# Altium schematic sheet MainCircuit.SchDoc: Controlador PID
size A4; Organization: Altium Limited; Address1: L3, 12a Rodborough Rd; Address2: Frenchs Forest; Address3: NSW; Address4: Australia 2086; Revision: R01; sheetnumberh: 2; sheettotall: 5; Alumno: Irumberry Juan - Matwiejczuk Leandro; Curso: 512; Materia: Técnicas Digitales III; Docentes: Ing. Marín Ariel; SheetNumber: 2; SheetTotal: 5
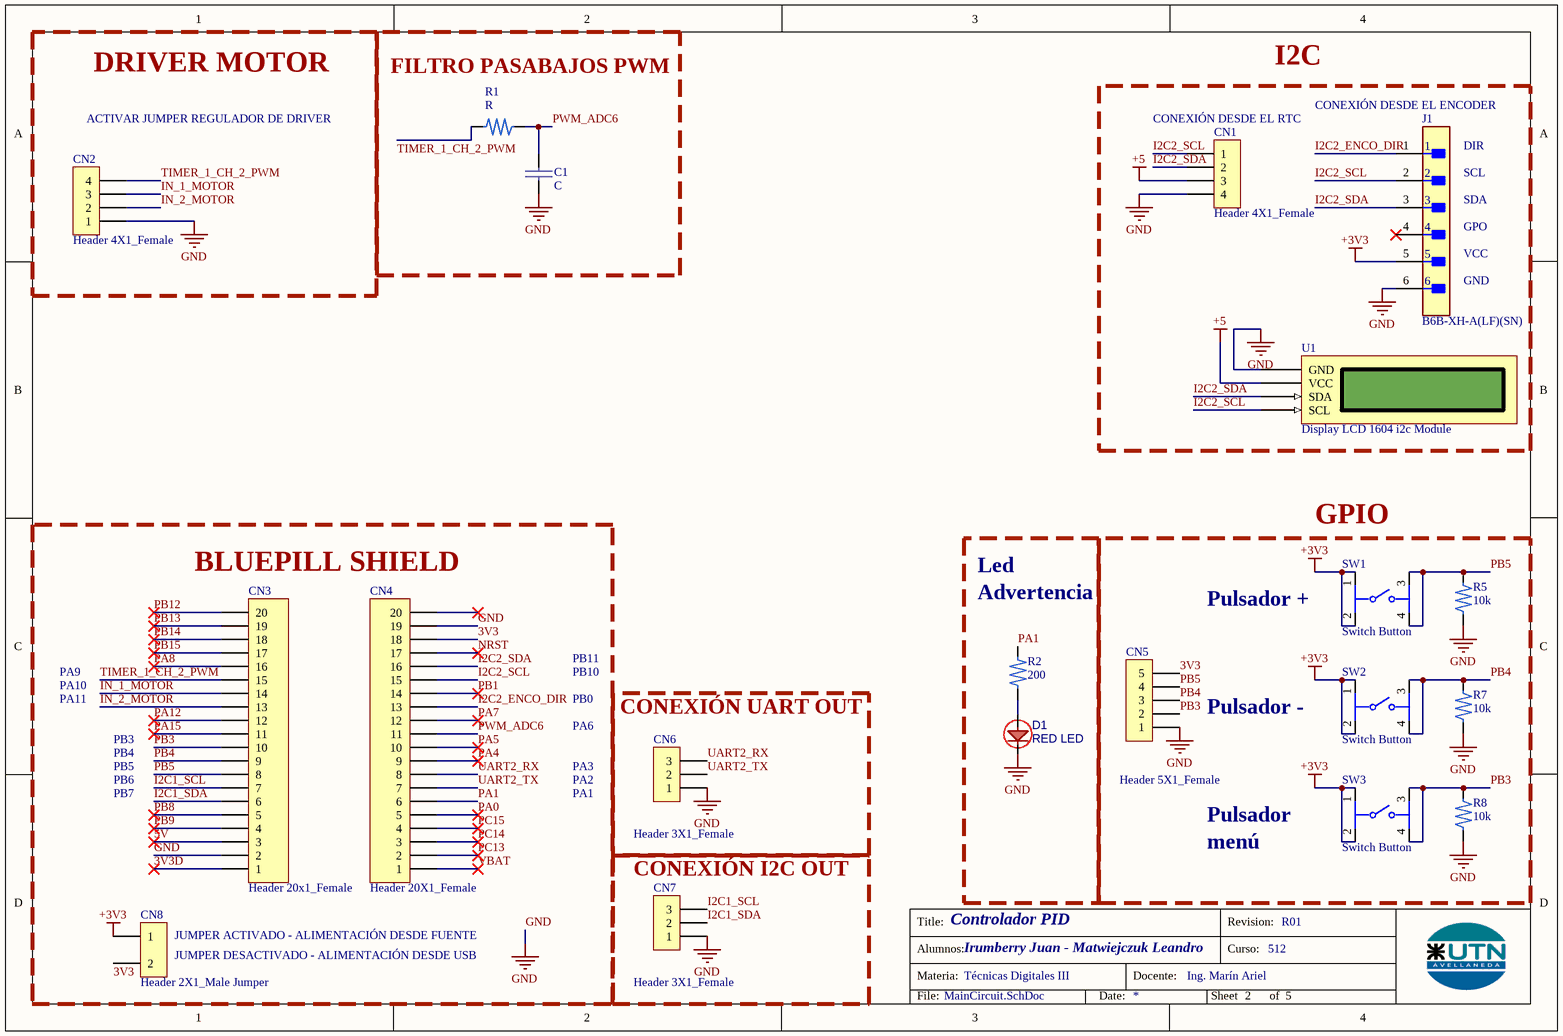
[diagram p0: MainCircuit.SchDoc]

## Parts
C1  C  [CAP_Axial_0.2mm]
CN1  Header 4X1_Female  [1*4P_FEMALE]
CN2  Header 4X1_Female  [1*4P_FEMALE]
CN3  Header 20x1_Female  [1*20P_FEMALE]
CN4  Header 20X1_Female  [1*20P_FEMALE]
CN5  Header 5X1_Female  [1*5P_FEMALE]
CN6  Header 3X1_Female  [1*3P_FEMALE]
CN7  Header 3X1_Female  [1*3P_FEMALE]
CN8  Header 2X1_Male Jumper  [JUMPER 2x1 PIN]
D1  RED LED  [LED_DIODE_3.9mm]
J1  B6B-XH-A(LF)(SN)  [JST 6 PIN CONNECTOR]
R1  R  [RES_AXIAL_3.2_6MM]
R2  200  [RES_AXIAL_3.2_6MM]
R5  10k  [RES_AXIAL_3.2_6MM]  (graphical)
R7  10k  [RES_AXIAL_3.2_6MM]  (graphical)
R8  10k  [RES_AXIAL_3.2_6MM]  (graphical)
SW1  Switch Button  [SWITCH]  (graphical)
SW2  Switch Button  [SWITCH]  (graphical)
SW3  Switch Button  [SWITCH]  (graphical)
U1  Display LCD 1604 i2c Module  [1*4P_FEMALE]

## Blocks framed on the sheet
DRIVER MOTOR: CN2
FILTRO PASABAJOS PWM: C1 R1
I2C: CN1 J1 U1
BLUEPILL SHIELD: CN3 CN4 CN8
GPIO: CN5 R5 R7 R8 SW1-SW3
CONEXIÓN UART OUT: CN6
CONEXIÓN I2C OUT: CN7

## Nets
+3V3: CN8.1 J1.5 SW1.1 SW1.2 SW2.1 SW2.2 SW3.1 SW3.2
+5: CN1.3 U1.2(VCC)
GND: C1.2 CN1.4 CN2.1 CN3.2 CN4.19 CN5.1 CN6.1 CN7.1 D1.K J1.6 R5.1 R7.1 R8.1 U1.1(GND)
3V3: CN4.18 CN5.5 CN8.2
3V3D: CN3.1
5V: CN3.3
I2C1_SCL: CN3.7 CN7.3
I2C1_SDA: CN3.6 CN7.2
I2C2_ENCO_DIR: CN4.13 J1.1
I2C2_SCL: CN1.1 CN4.15 J1.2 U1.4(SCL)
I2C2_SDA: CN1.2 CN4.16 J1.3 U1.3(SDA)
IN_1_MOTOR: CN2.3 CN3.14
IN_2_MOTOR: CN2.2 CN3.13
NRST: CN4.17
PA0: CN4.5
PA1: CN4.6 R2.2
PA4: CN4.9
PA5: CN4.10
PA7: CN4.12
PA8: CN3.16
PA12: CN3.12
PA15: CN3.11
PB1: CN4.14
PB3: CN3.10 CN5.2 R8.2 SW3.3 SW3.4
PB4: CN3.9 CN5.3 R7.2 SW2.3 SW2.4
PB5: CN3.8 CN5.4 R5.2 SW1.3 SW1.4
PB8: CN3.5
PB9: CN3.4
PB12: CN3.20
PB13: CN3.19
PB14: CN3.18
PB15: CN3.17
PC13: CN4.2
PC14: CN4.3
PC15: CN4.4
PWM_ADC6: C1.1 CN4.11 R1.2
TIMER_1_CH_2_PWM: CN2.4 CN3.15 R1.1
UART2_RX: CN4.8 CN6.3
UART2_TX: CN4.7 CN6.2
VBAT: CN4.1
NetD1_A: D1.A R2.1

Not connected (* = marked no-connect by the designer): CN4 20*; J1 4*

## Notes on the sheet
- (near J1) CONEXIÓN DESDE EL ENCODER
- ACTIVAR JUMPER REGULADOR DE DRIVER
- (near CN1) CONEXIÓN DESDE EL RTC
- (near J1) DIR
- (near J1) SCL
- (near J1) SDA
- (near J1) GPO
- (near J1) VCC
- (near J1) GND
- Led
- Advertencia
- (near SW1) Pulsador +
- PA9
- PA10
- PA11
- PB10
- PB11
- PB0
- Pulsador -
- PB6
- PB3
- PB4
- PB5
- PA6
- PA2
- PA3
- PB7
- PA1
- Pulsador
- menú
- (near CN8) JUMPER ACTIVADO - ALIMENTACIÓN DESDE FUENTE
- (near CN8) JUMPER DESACTIVADO - ALIMENTACIÓN DESDE USB
- Title:
- Revision:
- Alumnos:
- Materia:
- Docente:
- Curso:
- File:
- Date:
- Sheet
- of

## Library data of the parts
C1 = CAP_NP: Non-Polarized Capacitor
CN1 CN2 = Header 4X1_Female: Header, 4-Pin, Single row,female; LatestRevisionDate: 17-Jul-2002; LatestRevisionNote: Re-released for DXP Platform.; Publisher: Altium Limited
CN3 CN4 = Header 20x1_Female: Header, 16-Pin, Single row,female
CN5 = Header 5X1_Female: Header, 5-Pin, Single row,female; LatestRevisionDate: 17-Jul-2002; LatestRevisionNote: Re-released for DXP Platform.; Publisher: Altium Limited
CN6 CN7 = Header 3X1_Female: Header, 3-Pin, Single row,female; LatestRevisionDate: 17-Jul-2002; LatestRevisionNote: Re-released for DXP Platform.; Publisher: Altium Limited
CN8 = Jumper 2 Pin: Header, 2-Pin, Single row,male; LatestRevisionDate: 17-Jul-2002; LatestRevisionNote: Re-released for DXP Platform.; Publisher: Altium Limited
D1 = LED
J1 = JST 6 PIN: CONN HEADER VERT 6POS 2.5MM
R1 R2 R5 R7 R8 = RES: Through-hole Resistor
SW1-SW3 = Switch Button: SWITCH TACTILE SPST-NO 0.05A 24V; Manufacturer: TE Connectivity; Manufacturer Part Number: 1-1825910-4; Operating Force: 160gf; Contact Current Rating: 50mA; Electromechanical Life: 100000Cycles; Contact Resistance: 100mΩ; Octopart: https://octopart.com/1-1825910-4-te+connectivity-42270468; ComponentLink2URL: https://www.te.com/commerce/DocumentDelivery/DDEController?Action=showdoc&DocId=Customer+Drawing%7F1825910%7FC10%7Fpdf%7FEnglish%7FENG_CD_1825910_C10.pdf%7F1-1825910-4; Throw Configuration: SPST-NO; Height: 9.8mm; Package: 1-1825910-4; Automotive: No; Device Class L2: Switches; Voltage Rating Dc: 24V; Temperature Range High: +85°C; Device Class L3: Tactile Switches; Mouser Description: Tactile Switches 6MM ACTHIGH TEMP TACT SWITCH; Lead Free: Yes; Temperature Range Low: -35°C; Digikey Description: SWITCH TACTILE SPST-NO 0.05A 24V; Device Class L1: Electromechanical; Mount: Through Hole; RoHS: TRUE; ComponentLink2Description: Datasheet; Temperature: -35°C to +85°C; Category: Switch